# Altium schematic sheet USB-RS232_A2.SchDoc: Приставка
size 594 x 420 mm; ApprovedBy: Рогов; CheckedBy: Капустин; DrawnBy: Антонов; DocumentNumber: СПбПУ 11.01.19 ЭЗ; SheetTotal: 1; Format: A2; DocumentType: Схема электрическая  прнципиальная; Title1str: Преобразователя напряжения; ImagePath: СПбПУ 11.01.19 ЭЗ
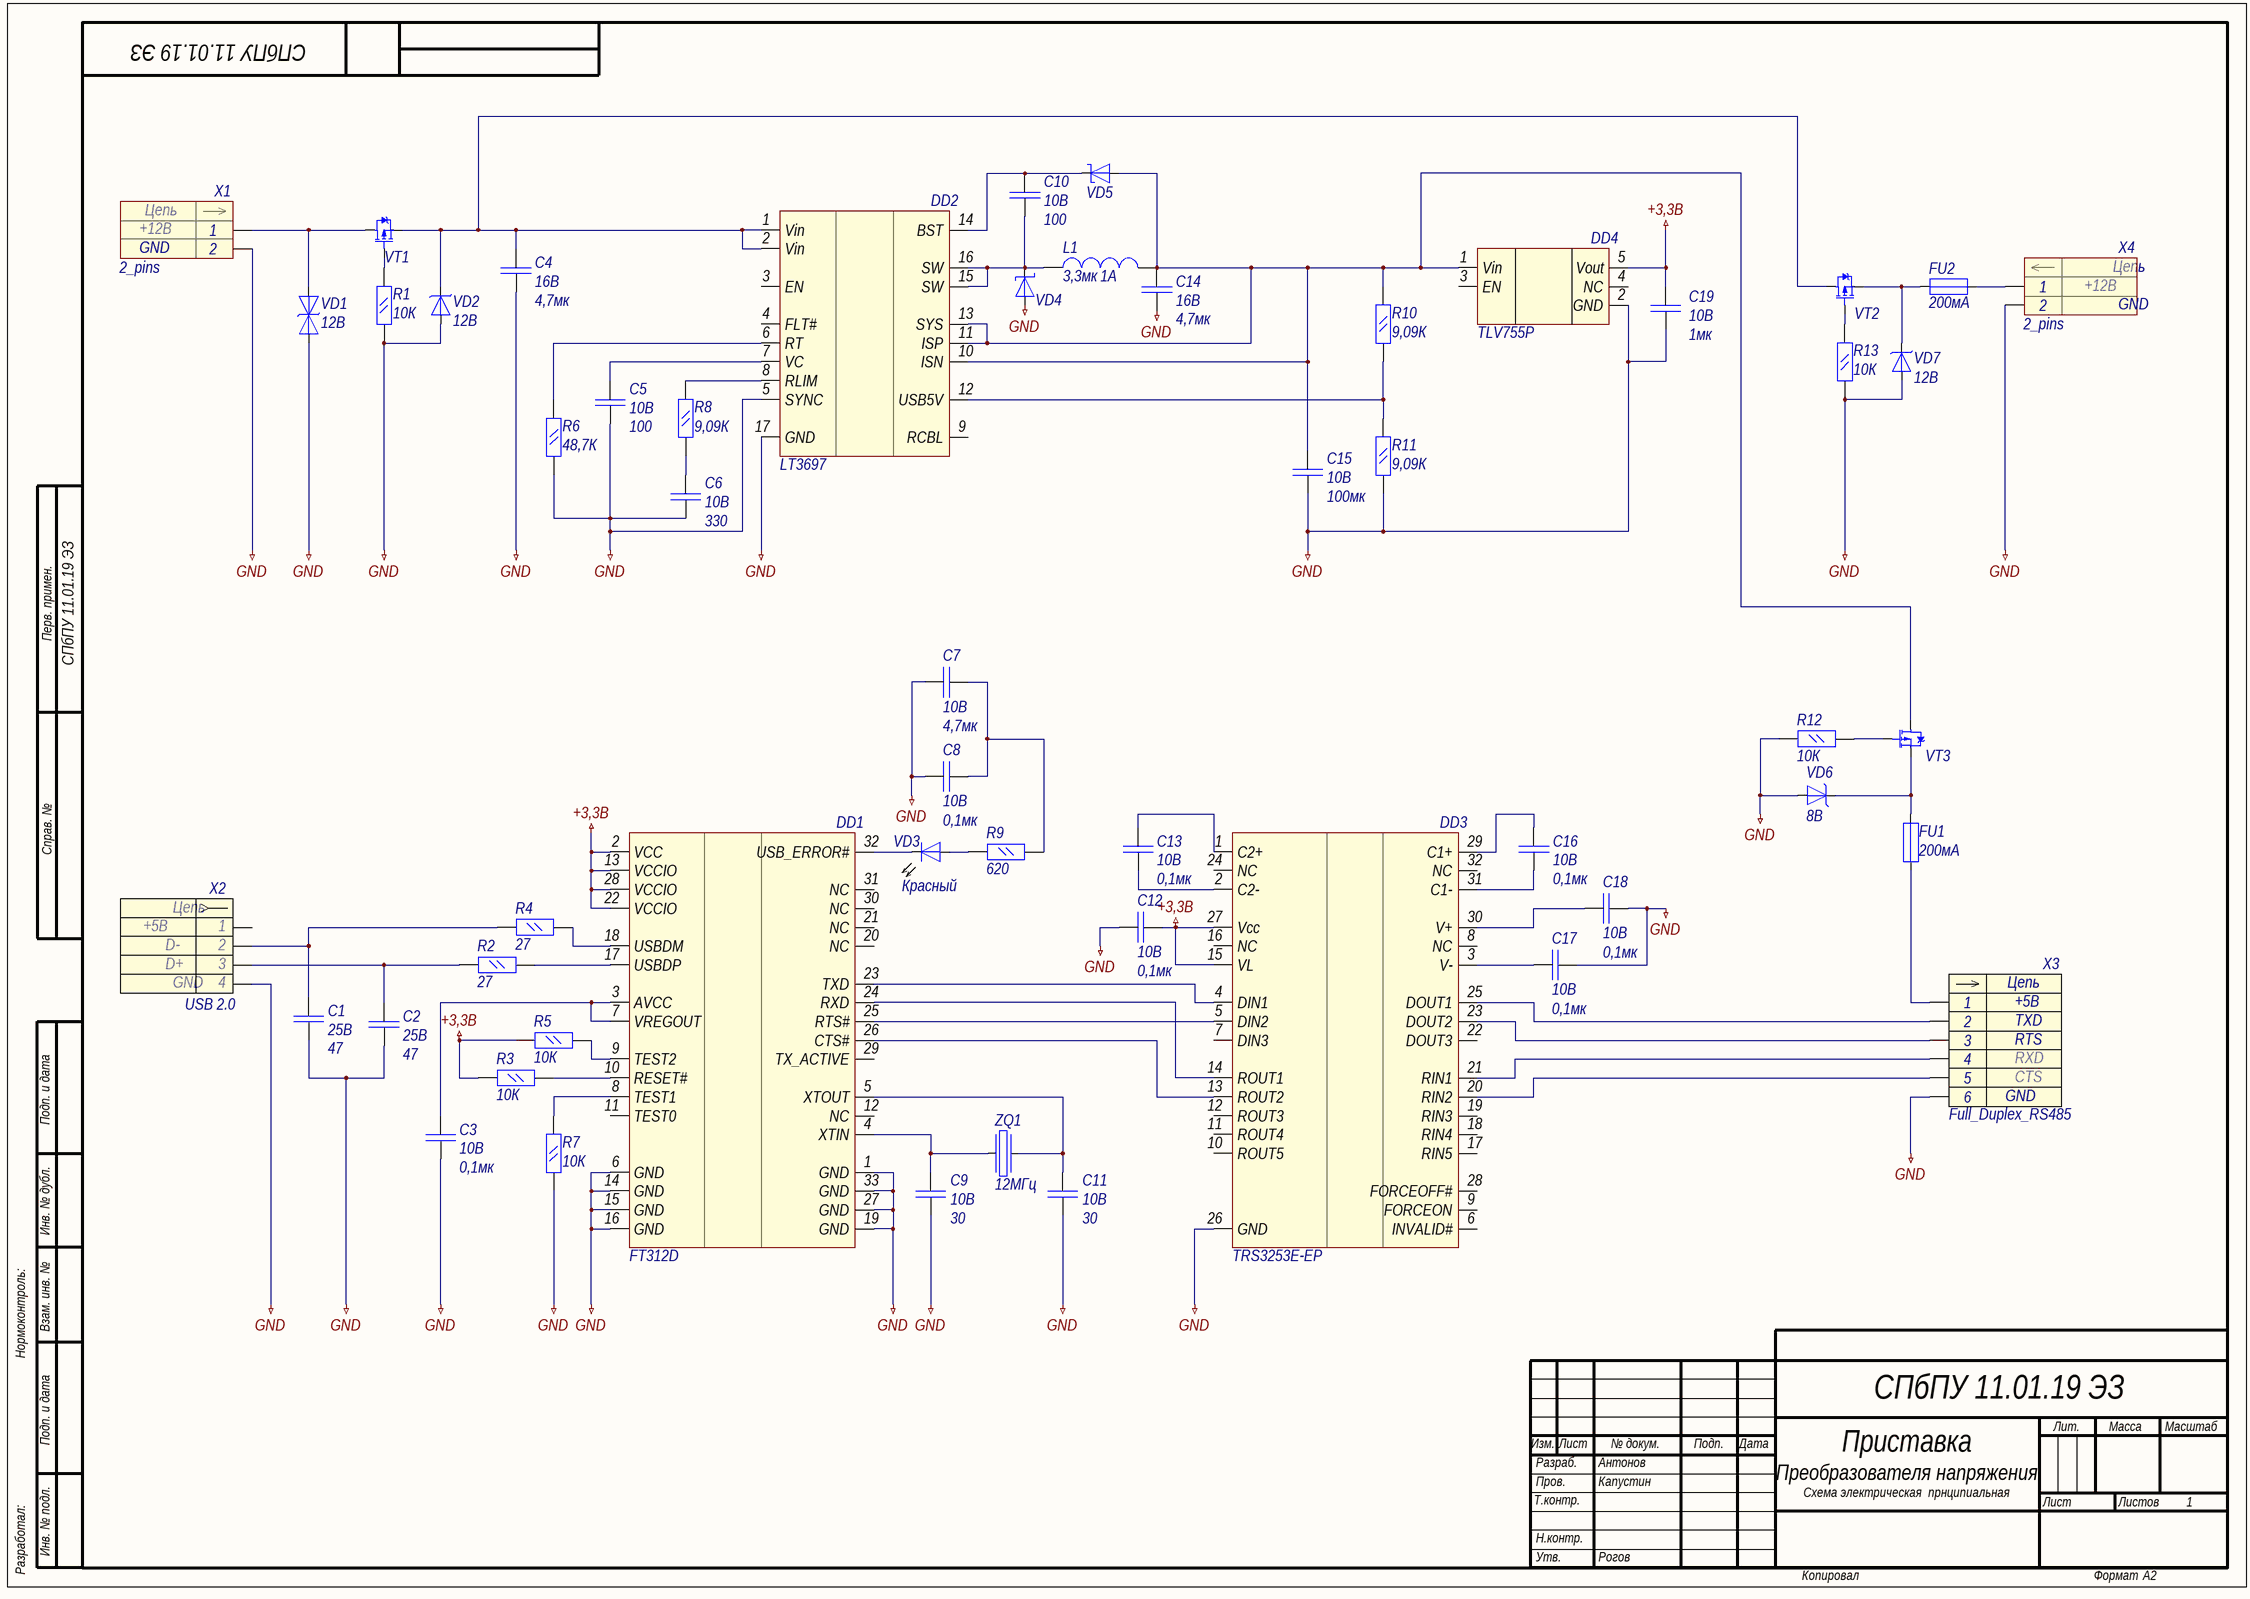
[diagram p0: USB-RS232_A2.SchDoc]

## Parts
C1  Voltage: 25В  Capacitance: 47  [CH0201C]  (hidden comment: Capacitor)
C2  Voltage: 25В  Capacitance: 47  [CH0201C]  (hidden comment: Capacitor)
C3  Voltage: 10В  Capacitance: 0,1мк  [CH0402C]  (hidden comment: Capacitor)
C4  Voltage: 16В  Capacitance: 4,7мк  [CH0603C]  (hidden comment: Capacitor)
C5  Voltage: 10В  Capacitance: 100  [CH0201C]  (hidden comment: Capacitor)
C6  Voltage: 10В  Capacitance: 330  [CH0402C]  (hidden comment: Capacitor)
C7  Voltage: 10В  Capacitance: 4,7мк  [CH0402C]  (hidden comment: Capacitor)
C8  Voltage: 10В  Capacitance: 0,1мк  [CH0402C]  (hidden comment: Capacitor)
C9  Voltage: 10В  Capacitance: 30  [CH0201C]  (hidden comment: Capacitor)
C10  Voltage: 10В  Capacitance: 100  [CH0201C]  (hidden comment: Capacitor)
C11  Voltage: 10В  Capacitance: 30  [CH0201C]  (hidden comment: Capacitor)
C12  Voltage: 10В  Capacitance: 0,1мк  [CH0402C]  (hidden comment: Capacitor)
C13  Voltage: 10В  Capacitance: 0,1мк  [CH0402C]  (hidden comment: Capacitor)
C14  Voltage: 16В  Capacitance: 4,7мк  [CH0603C]  (hidden comment: Capacitor)
C15  Voltage: 10В  Capacitance: 100мк  [CH1206C]  (hidden comment: Capacitor)
C16  Voltage: 10В  Capacitance: 0,1мк  [CH0402C]  (hidden comment: Capacitor)
C17  Voltage: 10В  Capacitance: 0,1мк  [CH0402C]  (hidden comment: Capacitor)
C18  Voltage: 10В  Capacitance: 0,1мк  [CH0402C]  (hidden comment: Capacitor)
C19  Voltage: 10В  Capacitance: 1мк  [CH0201C]  (hidden comment: Capacitor)
DD1  FT312D  [FT312D]
DD2  LT3697  [LT3697]
DD3  TRS3253E-EP  [TRS3253E-EP]
DD4  TLV755P  [SOT23-5]
FU1  value 200мА  [CH0402R]  (hidden comment: Fuse)
FU2  value 200мА  [CH0402R]  (hidden comment: Fuse)
L1  Max current: 1А  Inductance: 3,3мк  [CH0805L]  (hidden comment: *)
R1  Impedance: 10К  [CH0402R]  (hidden comment: Res_0.125)
R2  Impedance: 27  [CH0402R]  (hidden comment: Res_0.125)
R3  Impedance: 10К  [CH0402R]  (hidden comment: Res_0.125)
R4  Impedance: 27  [CH0402R]  (hidden comment: Res_0.125)
R5  Impedance: 10К  [CH0402R]  (hidden comment: Res_0.125)
R6  Impedance: 48,7К  [CH0805R]  (hidden comment: Res_0.125)
R7  Impedance: 10К  [CH0402R]  (hidden comment: Res_0.125)
R8  Impedance: 9,09К  [CH0805R]  (hidden comment: Res_0.125)
R9  Impedance: 620  [CH0402R]  (hidden comment: Res_0.125)
R10  Impedance: 9,09К  [CH0805R]  (hidden comment: Res_0.125)
R11  Impedance: 9,09К  [CH0805R]  (hidden comment: Res_0.125)
R12  Impedance: 10К  [CH0402R]  (hidden comment: Res_0.125)
R13  Impedance: 10К  [CH0402R]  (hidden comment: Res_0.125)
VD1  Clamping Voltage: 12В  [CH0201L]  (hidden comment: TVS-diod_simmetrical)
VD2  Clamping_Voltage: 12В  [DO214AA]  (hidden comment: TVS-diod_directed)
VD3  Color: Красный  [CH0201L]  (hidden comment: Light_diod)
VD4  Diod Schottky  [DO214AA]  (value not drawn)
VD5  Diod Schottky  [SOT23_132]  (value not drawn)
VD6  Clamping_Voltage: 8В  [SOD123W]  (hidden comment: TVS-diod_directed)
VD7  Clamping_Voltage: 12В  [DO214AA]  (hidden comment: TVS-diod_directed)
VT1  *  [SOT23_132]  (value not drawn)
VT2  *  [SOT23_132]  (value not drawn)
VT3  *  [SOT23_132]  (value not drawn)
X1  2_pins  Vcc: +12В  [CON: 163-179PH-EX]
X2  USB 2.0  Vcc: +5В  [USB]
X3  Full_Duplex_RS485  Z: RXD  Y: CTS  Vcc: +5В  A: TXD  B: RTS  [CON: PBS-6]
X4  2_pins  Vcc: +12В  [CON: PBS-2]
ZQ1  value 12МГц  [OSC: 5032]  (hidden comment: Oscillator)

## Nets
+3,3В: C12.2(C1-) C19.1(C1+) DD1.2(VCC) DD1.13(VCCIO) DD1.22(VCCIO) DD1.28(VCCIO) DD3.15(VL) DD3.27(Vcc) DD4.5(Vout) R3.2(C1-) R5.2(C1-)
GND: C1.2(C1-) C2.2(C1-) C3.2(C1-) C4.2(C1-) C5.2(C1-) C6.2(C1-) C7.1(C1+) C8.1(C1+) C9.2(C1-) C11.2(C1-) C12.1(C1+) C14.2(C1-) C15.2(C1-) C17.2(C1-) C18.2(C1-) C19.2(C1-) DD1.1(GND) DD1.6(GND) DD1.14(GND) DD1.15(GND) DD1.16(GND) DD1.19(GND) DD1.27(GND) DD1.33(GND) DD2.5(SYNC) DD2.17(GND) DD3.26(GND) DD4.2(GND) R1.1(C1-) R6.2(C1-) R7.1(C1-) R11.2(C1-) R12.2(C1-) R13.1(C1-) VD1.1(A) VD2.1(A) VD4.1 VD6.1(A) VD7.1(A) X1.2 X2.4 X3.6 X4.2
NetC1_1: C1.1(C1+) R4.2(C1-) X2.2
NetC2_1: C2.1(C1+) R2.2(C1-) X2.3
NetC3_1: C3.1(C1+) DD1.3(AVCC) DD1.7(VREGOUT)
NetC4_1: C4.1(C1+) DD2.1(Vin) DD2.2(Vin) VD2.2(C) VT1.3(S) VT2.2(D)
NetC5_1: C5.1(C1+) DD2.7(VC)
NetC6_1: C6.1(C1+) R8.2(C1-)
NetC7_2: C7.2(C1-) C8.2(C1-) R9.1(C1-)
NetC9_1: C9.1(C1+) DD1.4(XTIN) ZQ1.1
NetC10_1: C10.1(C1+) DD2.14(BST) VD5.2
NetC10_2: C10.2(C1-) DD2.15(SW) DD2.16(SW) L1.1(C1-) VD4.2
NetC11_1: C11.1(C1+) DD1.5(XTOUT) ZQ1.3
NetC13_1: C13.1(C1+) DD3.1(C2+)
NetC13_2: C13.2(C1-) DD3.2(C2-)
NetC14_1: C14.1(C1+) C15.1(C1+) DD2.10(ISN) DD2.11(ISP) DD2.13(SYS) DD4.1(Vin) L1.2 R10.1(C1-) VD5.1 VT3.2(D)
NetC16_1: C16.1(C1+) DD3.29(C1+)
NetC16_2: C16.2(C1-) DD3.31(C1-)
NetC17_1: C17.1(C1+) DD3.3(V-)
NetC18_1: C18.1(C1+) DD3.30(V+)
NetDD1_8: DD1.8(TEST1) R7.2(C1-)
NetDD1_9: DD1.9(TEST2) R5.1(C1-)
NetDD1_10: DD1.10(RESET#) R3.1(C1-)
NetDD1_17: DD1.17(USBDP) R2.1(C1-)
NetDD1_18: DD1.18(USBDM) R4.1(C1-)
NetDD1_23: DD1.23(TXD) DD3.4(DIN1)
NetDD1_24: DD1.24(RXD) DD3.14(ROUT1)
NetDD1_25: DD1.25(RTS#) DD3.5(DIN2)
NetDD1_26: DD1.26(CTS#) DD3.13(ROUT2)
NetDD1_32: DD1.32(USB_ERROR#) VD3.2
NetDD2_6: DD2.6(RT) R6.1(C1-)
NetDD2_8: DD2.8(RLIM) R8.1(C1-)
NetDD2_12: DD2.12(USB5V) R10.2(C1-) R11.1(C1-)
NetDD3_20: DD3.20(RIN2) X3.5
NetDD3_21: DD3.21(RIN1) X3.4
NetDD3_23: DD3.23(DOUT2) X3.3
NetDD3_25: DD3.25(DOUT1) X3.2
NetFU1_1: FU1.1 X3.1
NetFU1_2: FU1.2 VD6.2(C) VT3.3(S)
NetFU2_1: FU2.1 VD7.2(C) VT2.3(S)
NetFU2_2: FU2.2 X4.1
NetR1_2: R1.2(C1-) VT1.1(G)
NetR9_2: R9.2(C1-) VD3.1
NetR12_1: R12.1(C1-) VT3.1(G)
NetR13_2: R13.2(C1-) VT2.1(G)
NetVD1_2: VD1.2(C) VT1.2(D) X1.1

Not connected (* = marked no-connect by the designer): DD1 11(TEST0) 12(NC) 20(NC) 21(NC) 29(TX_ACTIVE) 30(NC) 31(NC); DD2 3(EN) 4(FLT#) 9(RCBL); DD3 6(INVALID#) 7(DIN3) 8(NC) 9(FORCEON) 10(ROUT5) 11(ROUT4) 12(ROUT3) 16(NC) 17(RIN5) 18(RIN4) 19(RIN3) 22(DOUT3) 24(NC) 28(FORCEOFF#) 32(NC); DD4 3(EN) 4(NC); X2 1

## Notes on the sheet
- Перв. примен.
- Справ. №
- Подп. и дата
- Инв. № дубл.
- Нормоконтроль:
- Взам. инв. №
- Изм.
- Лист
- № докум.
- Подп.
- Дата
- Лит.
- Масса
- Масштаб
- Т.контр.
- Пров.
- Разраб.
- Листов
- Разработал:
- Инв. № подл.
- Н.контр.
- Утв.
- Копировал
- Формат
- (in symbol 2_pins) Цепь; GND
- (in symbol Full_Duplex_RS485) Цепь; GND
- (in symbol USB-A) Цепь; D-; D+; GND

## Library data of the parts
C1 C2 = Capacitor: Manufacture: TDK; Model: CGA1A2C0G1E470J030BA; Case: 0201; HelpURL: https://ru.mouser.com/ProductDetail/TDK/CGA1A2C0G1E470J030BA?qs=LcTL%2f5vFEzGP84WOj%2f5Msw==&utm_source=netcomponents&utm_medium=aggregator&utm_campaign=CGA1A2C0G1E470J030BA&utm_term=CGA1A2C0G1E470J030BA&utm_content=TDK
C3 C8 C12 C13 C16-C18 = Capacitor: Manufacture: AVX; Model: 0402ZD103KAT2A; Case: 0402; HelpURL: https://ru.mouser.com/ProductDetail/AVX/0402ZD103KAT2A?qs=sGAEpiMZZMs0AnBnWHyRQKdiqyDPVQdAu74W%2fwwRq8A%3d
C4 C14 = Capacitor: Manufacture: Murata Electronics; Model: GRM188R61C475KAAJD; Case: 0603; HelpURL: https://ru.mouser.com/ProductDetail/Murata-Electronics/GRM188R61C475KAAJD?qs=sGAEpiMZZMs0AnBnWHyRQHS%2f3XE0oMwxE3tFP4oDIiY%3d
C5 C10 = Capacitor: Manufacture: KEMET; Model: C0201C101K8GACTU; Case: 0201; HelpURL: https://ru.mouser.com/ProductDetail/KEMET/C0201C101K8GACTU?qs=sGAEpiMZZMs0AnBnWHyRQB5KqWiNAtmEn9gsTWOdKS%252b7RrFbxqtALA%3d%3d
C6 = Capacitor: Manufacture: Vishay / Vitramon; Model: VJ0402Y331MXQCW1BC; Case: 0402; HelpURL: https://ru.mouser.com/ProductDetail/Vishay-Vitramon/VJ0402Y331MXQCW1BC?qs=sGAEpiMZZMs0AnBnWHyRQHefeAIkSpb%2fKjIwGvKZvs8%3d
C7 = Capacitor: Manufacture: Murata Electronics; Model: ZRB15XR61A475KE01D; Case: 0402; HelpURL: https://ru.mouser.com/ProductDetail/Murata-Electronics/ZRB15XR61A475KE01D?qs=sGAEpiMZZMs0AnBnWHyRQO9VYadaKTO%252beZnE9zFUsbv4FmCibz4ZfQ%3d%3d
C9 C11 = Capacitor: Manufacture: KEMET; Model: CBR02C308B8GAC; Case: 0201; HelpURL: https://ru.mouser.com/ProductDetail/KEMET/CBR02C308B8GAC?qs=sGAEpiMZZMs0AnBnWHyRQKJCfzG%2fi9wHnix1yOwfSPhOUzhoHh%252bTpQ%3d%3d
C15 = Capacitor: Manufacture: TDK; Model: C3216X5R1A107M160AC; Case: 1206; HelpURL: https://ru.mouser.com/ProductDetail/TDK/C3216X5R1A107M160AC?qs=sGAEpiMZZMs0AnBnWHyRQEWjzA2rN6H9eWVfGykJv7Q%3d
C19 = Capacitor: Manufacture: Murata Electronics; Model: GRM033C81A105ME05E; Case: 0201; HelpURL: https://ru.mouser.com/ProductDetail/Murata-Electronics/GRM033C81A105ME05E?qs=sGAEpiMZZMs0AnBnWHyRQN7%2fAA2D2lPPXfhIkJ3ChWM%252bNp28BKy3Ug%3d%3d
DD1 = FT312D: Ivan; Manufacture: FTDI, Future Technology Devices International Ltd; HelpURL: https://www.ftdichip.com/Products/ICs/FT312D.html; Case: QFN-32; Model: FT312D
DD2 = LT3697: 6~18 to 5; Manufacture: Analog Devices; Model: LT3697; HelpURL: https://www.analog.com/en/products/lt3697.html; Case: *
DD3 = TRS3253E-EP: UART - RS232; Manufacture: Texas Instruments; Model: TRS3253E-EP; Case: PQFN-32; HelpURL: http://www.ti.com/product/trs3253e-ep
DD4 = LDO +3.3V: Manufacture: Texas Instruments; Case: SOT-23; HelpUrL: http://www.ti.com/product/TLV755P?keyMatch=TLV755P&tisearch=Search-EN-Everything; Model: TLV755P
L1 = Inductor: Manufacture: Murata Electronics; Model: LQM21PZ3R3MGRD; Impedance: 150м; HelpURL: https://ru.mouser.com/ProductDetail/Murata-Electronics/LQM21PZ3R3MGRD?qs=sGAEpiMZZMsg%252by3WlYCkU2iuTbKTbm6Zxs6Ix4GkUPA%3d; Case: 0805
R1 R3 R5 R7 R12 R13 = Res_0.125: Manufacture: Yageo; Model: AC0402FR-7W10KL; Case: 0402; HelpURL: https://ru.mouser.com/ProductDetail/Yageo/AC0402FR-7W10KL?qs=sGAEpiMZZMvdGkrng054txbN%2f5LBcxld3gyqgmBuiXRPLjwmdNqO3A%3d%3d
R2 R4 = Res_0.125: Manufacture: TE Connectivity / Holsworthy; Model: CRGP0402F27R; Case: 0402; HelpURL: https://ru.mouser.com/ProductDetail/TE-Connectivity-Holsworthy/CRGP0402F27R?qs=sGAEpiMZZMvdGkrng054tz1y1XEHv7sN0eZin9YL6hr3b0ltiAndjw%3d%3d
R6 = Res_0.125: Manufacture: Panasonic Industrial Devices; Model: ERJ-6ENF4872V; Case: 0805; HelpURL: https://ru.mouser.com/ProductDetail/Panasonic-Industrial-Devices/ERJ-6ENF4872V?qs=sGAEpiMZZMvdGkrng054tx7%2f6%252bNA3LAJLLBsBMFOrm0%3d
R8 R10 R11 = Res_0.125: Manufacture: Panasonic Industrial Devices; Model: ERJ-6ENF9091V; Case: 0805; HelpURL: https://ru.mouser.com/ProductDetail/Panasonic-Industrial-Devices/ERJ-6ENF9091V?qs=sGAEpiMZZMvdGkrng054tx7%2f6%252bNA3LAJZkxjwUnWjWM%3d
R9 = Res_0.125: Manufacture: KOA Speer; Model: SG73S1ETTP621J; Case: 0402; HelpURL: https://ru.mouser.com/ProductDetail/KOA-Speer/SG73S1ETTP621J?qs=sGAEpiMZZMvdGkrng054t%2f16WM9J8YovuN0Q%2fxEmDr4%3d
VD1 = TVS-diod_simmetrical: Manufacturer: Littelfuse; Model: SP3022-01WTG; HelpURL: https://ru.mouser.com/ProductDetail/Littelfuse/SP3022-01WTG?qs=sGAEpiMZZMsItbzKdwyIez7NGmqnzL8h47KYC2e%252bM%2f4NVETz1A7KGA%3d%3d; Case: 0201
VD2 VD7 = TVS-diod_directed: Manufacturer: Bourns; Model: CD214B-T7.0ALF; HelpURL: https://ru.mouser.com/ProductDetail/Bourns/CD214B-T70ALF?qs=sGAEpiMZZMsItbzKdwyIexL102H4jKkFOiaKL2EcEgo%3d; Ipp: *; Case: DO-214AA-2
VD3 = Light_diod: Manufacture: Kingbright; Model: APG0603SURC-TT; Thresh_Voltage: 1,97В; If: 10мА; HelpURL: https://ru.mouser.com/ProductDetail/Kingbright/APG0603SURC-TT?qs=sGAEpiMZZMseGfSY3csMkWhaTYyynk7zWfpYoqHc%252biGwdyFqmyeODA%3D%3D
VD4 = Diod Schottky: Manufacturer: Rectron; Model: FM5822B-W; If: 3А; Vrrm: 40В; ComponentKind: *; HelpURL: https://ru.mouser.com/ProductDetail/Rectron/FM5822B-W?qs=sGAEpiMZZMtQ8nqTKtFS%2fGuc2LbLh1yNV0sywe9%2fy3k%3d
VD5 = Diod Schottky: Manufacturer: Toshiba; Model: 1SS374(TE85L,F); If: 200мА; Vrrm: 15В; ComponentKind: *; HelpURL: https://ru.mouser.com/ProductDetail/Toshiba/1SS374TE85LF?qs=sGAEpiMZZMtQ8nqTKtFS%2fOl9H8JU2QXlyYvmz0vcRmull8rlMQPxpQ%3d%3d
VD6 = TVS-diod_directed: Manufacturer: Nexperia; Model: PTVS3V3S1UTR,115; HelpURL: https://ru.mouser.com/ProductDetail/Nexperia/PTVS3V3S1UTR115?qs=sGAEpiMZZMsItbzKdwyIe55sLWjhUV0FnMtsDZGUovc%3d; Ipp: *; Case: SOD-123W
VT1 VT2 = P-Channel: Manufacture: Diodes Incorporated; Id: 2,4А; Model: DMG2301LK-7; Vgs: 300мВ; Vsd: 20В; HelpURL: https://ru.mouser.com/ProductDetail/Diodes-Incorporated/DMG2301LK-7?qs=sGAEpiMZZMshyDBzk1%2fWi3VK%2fMVeCy7TGgocA8mg7FfG8rajAhy0Kw%3d%3d
VT3 = P-Channel: Manufacture: Vishay / Siliconix; Id: 6А; Model: SI2329DS-T1-GE3; Vgs: 350мВ; Vsd: 8В; HelpURL: https://ru.mouser.com/ProductDetail/Vishay-Siliconix/SI2329DS-T1-GE3?qs=sGAEpiMZZMshyDBzk1%2fWi0IfsQ3%2f3bgnEGeh9AiMdAo%3d
X2 = USB-A: USB; Manufacturer: TE Connectivity; Model: 292303-2; HelpURL: https://www2.mouser.com/ProductDetail/Wurth-Electronics/629004113921?qs=35zkduByVmhHRkVkRjAlEQ==; ComponentKind: type A
ZQ1 = Oscillator: Manufacture: CTS Electronic Components; HelpURL: https://ru.mouser.com/ProductDetail/CTS-Electronic-Components/636L3I012M00000?qs=sGAEpiMZZMtldj7qu1ydrWzf7LKZ2EliIlXd3ltxwts%3d; Model: https://ru.mouser.com/ProductDetail/CTS-Electronic-Components/636L3I012M00000?qs=sGAEpiMZZMtldj7qu1ydrWzf7LKZ2EliIlXd3ltxwts%3d
FU1 FU2 = Fuse: HelpURL: https://www2.mouser.com/ProductDetail/Bourns/SF-0402FP020F-2?qs=sGAEpiMZZMtxU2g%2f1juGqWJziY9CkRY0v%252bd32oCrRTr%2fW8XqdHGjQA%3d%3d
X1 X4 = 2_pins
  X1: HelpURL: https://ru.farnell.com/gct-global-connector-technology/dcj250-10-a-k1-k/dc-power-jack-5a-20vdc-black/dp/2524130?st=power%20jack
  X4: HelpURL: https://ru.mouser.com/ProductDetail/Harwin/M50-3140245R?qs=sGAEpiMZZMs%252bGHln7q6pm8Vn94ktop%2FJtmD0IM0sqjtMooR%2Fqw0FIA%3D%3D
X3 = Full_Duplex_RS485: HelpURL: https://ru.mouser.com/ProductDetail/Harwin/M50-3140645?qs=sGAEpiMZZMs%252bGHln7q6pm8Vn94ktop%2FJjOh82Azijbg9ipiItTiXHg%3D%3D